# Altium project BMS_PCB.PrjPcb (part 1 of 3)
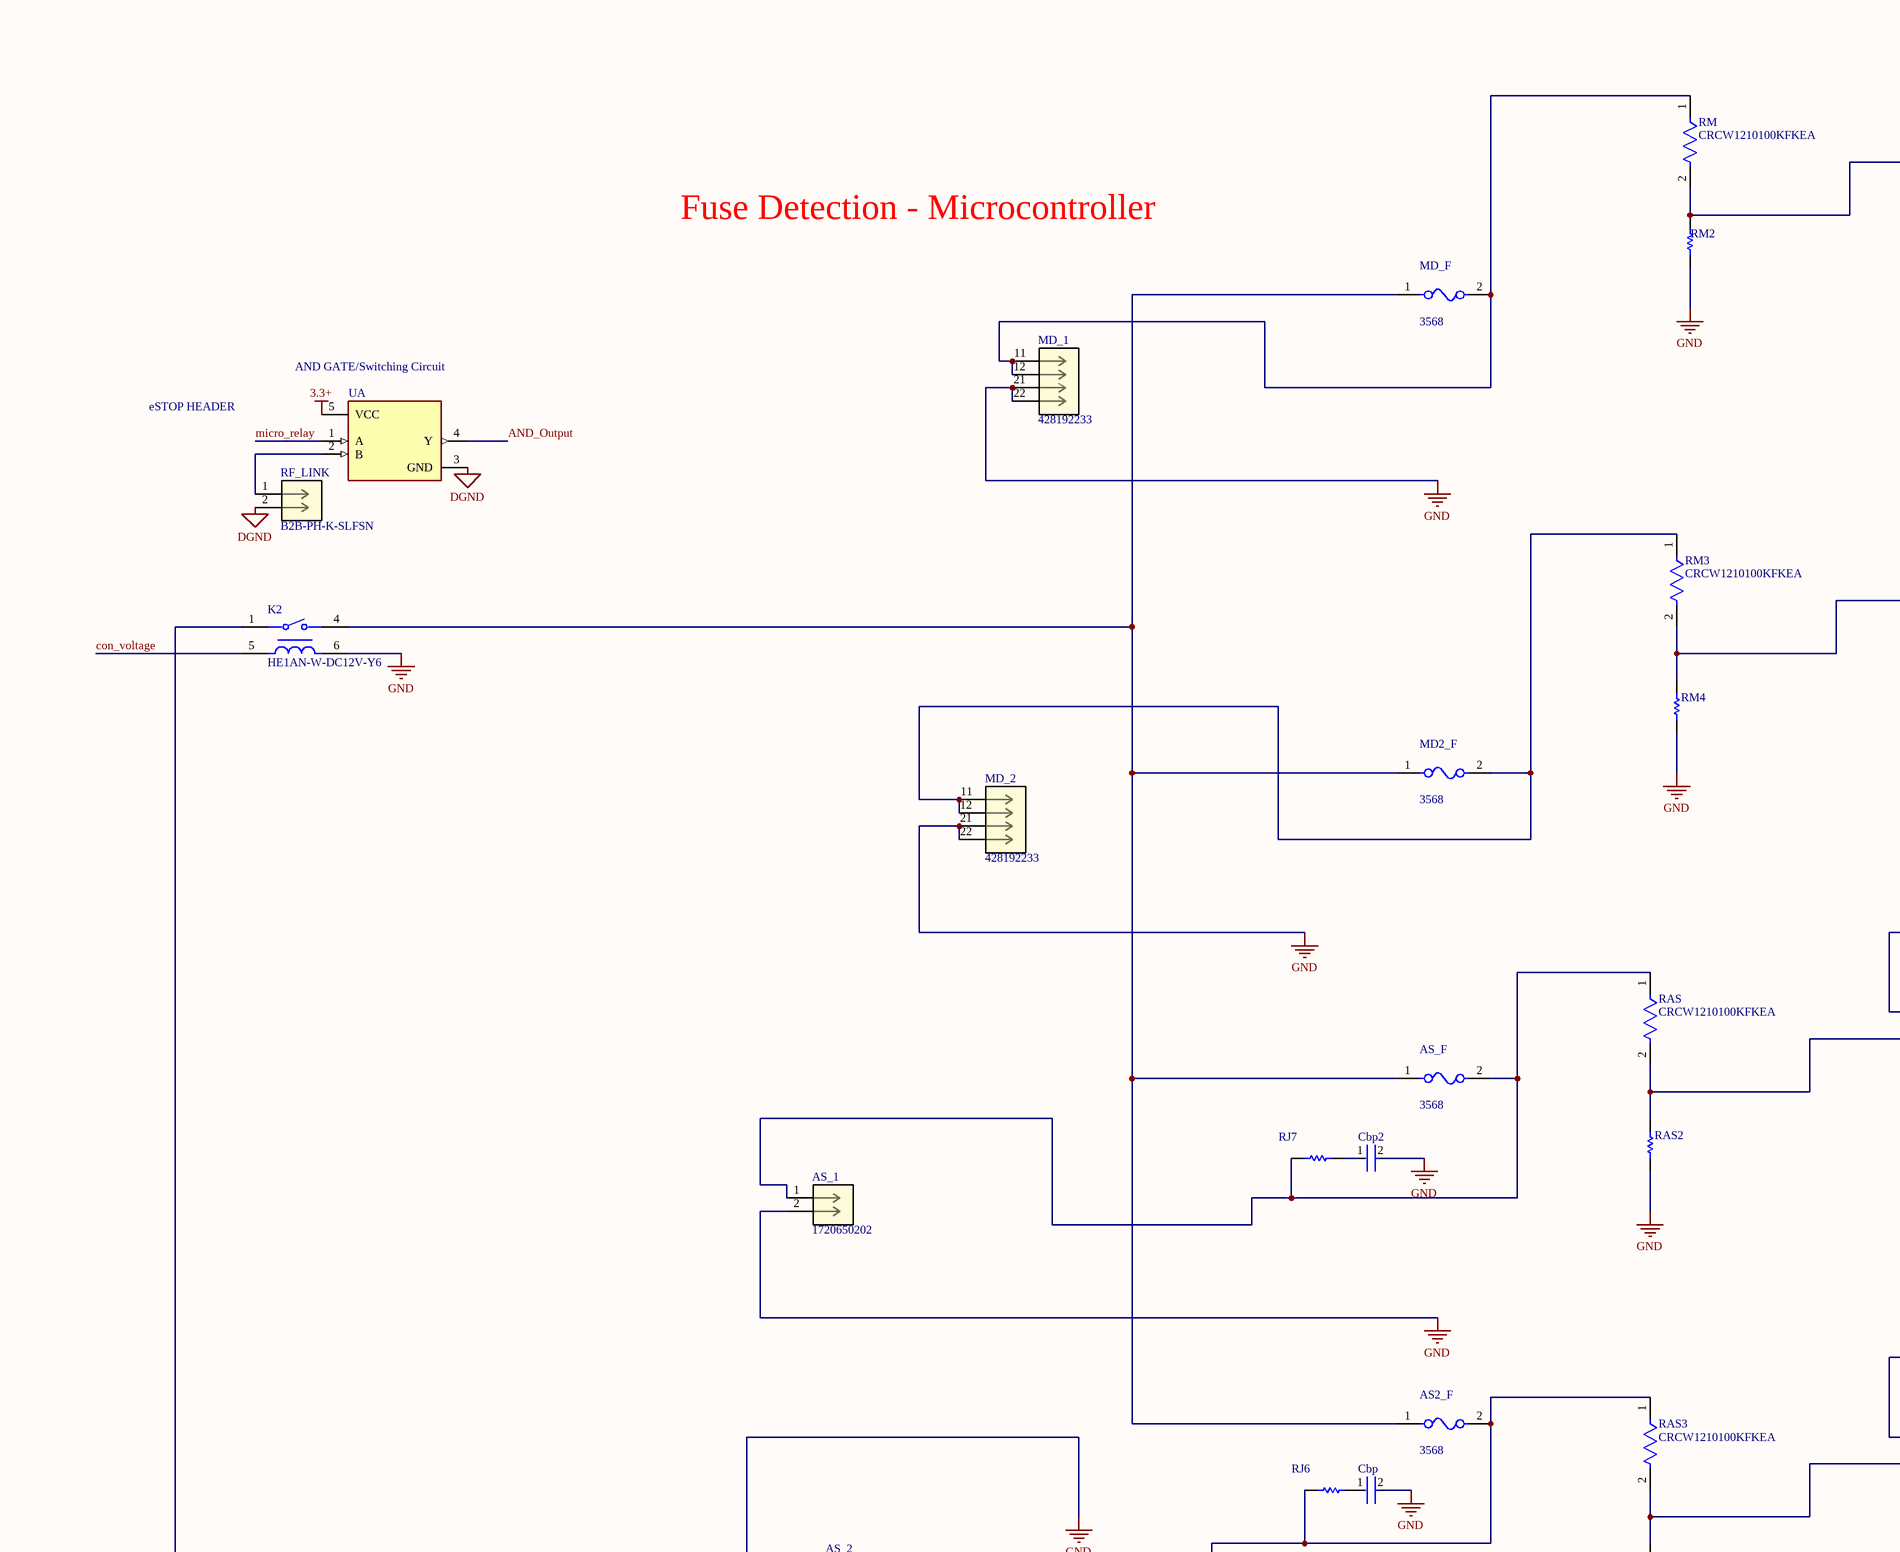
[diagram p0: BuckConverters.SchDoc, row 1 of 4 left]
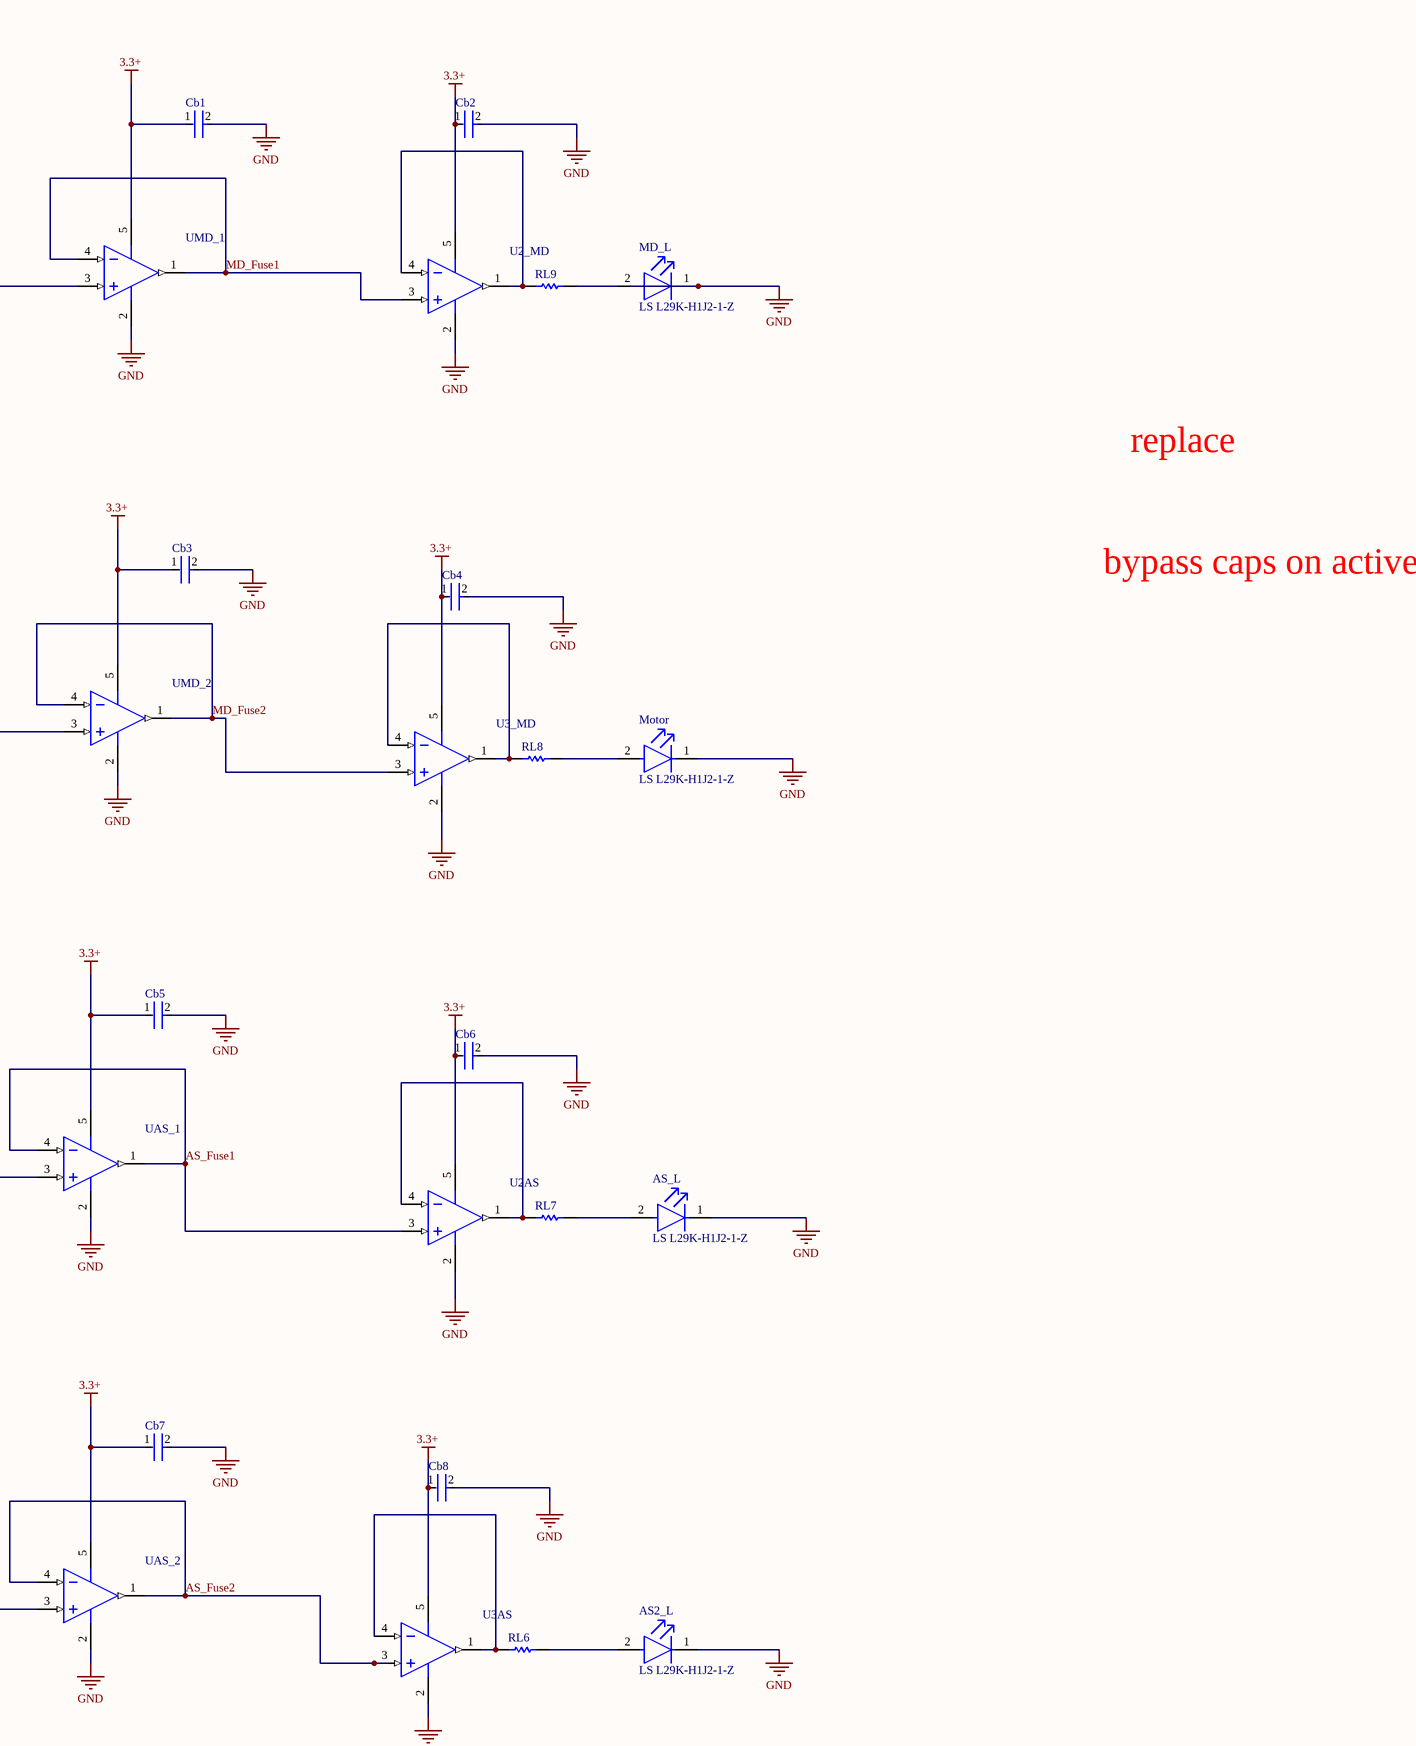
[diagram p1: BuckConverters.SchDoc, row 1 of 4 right]
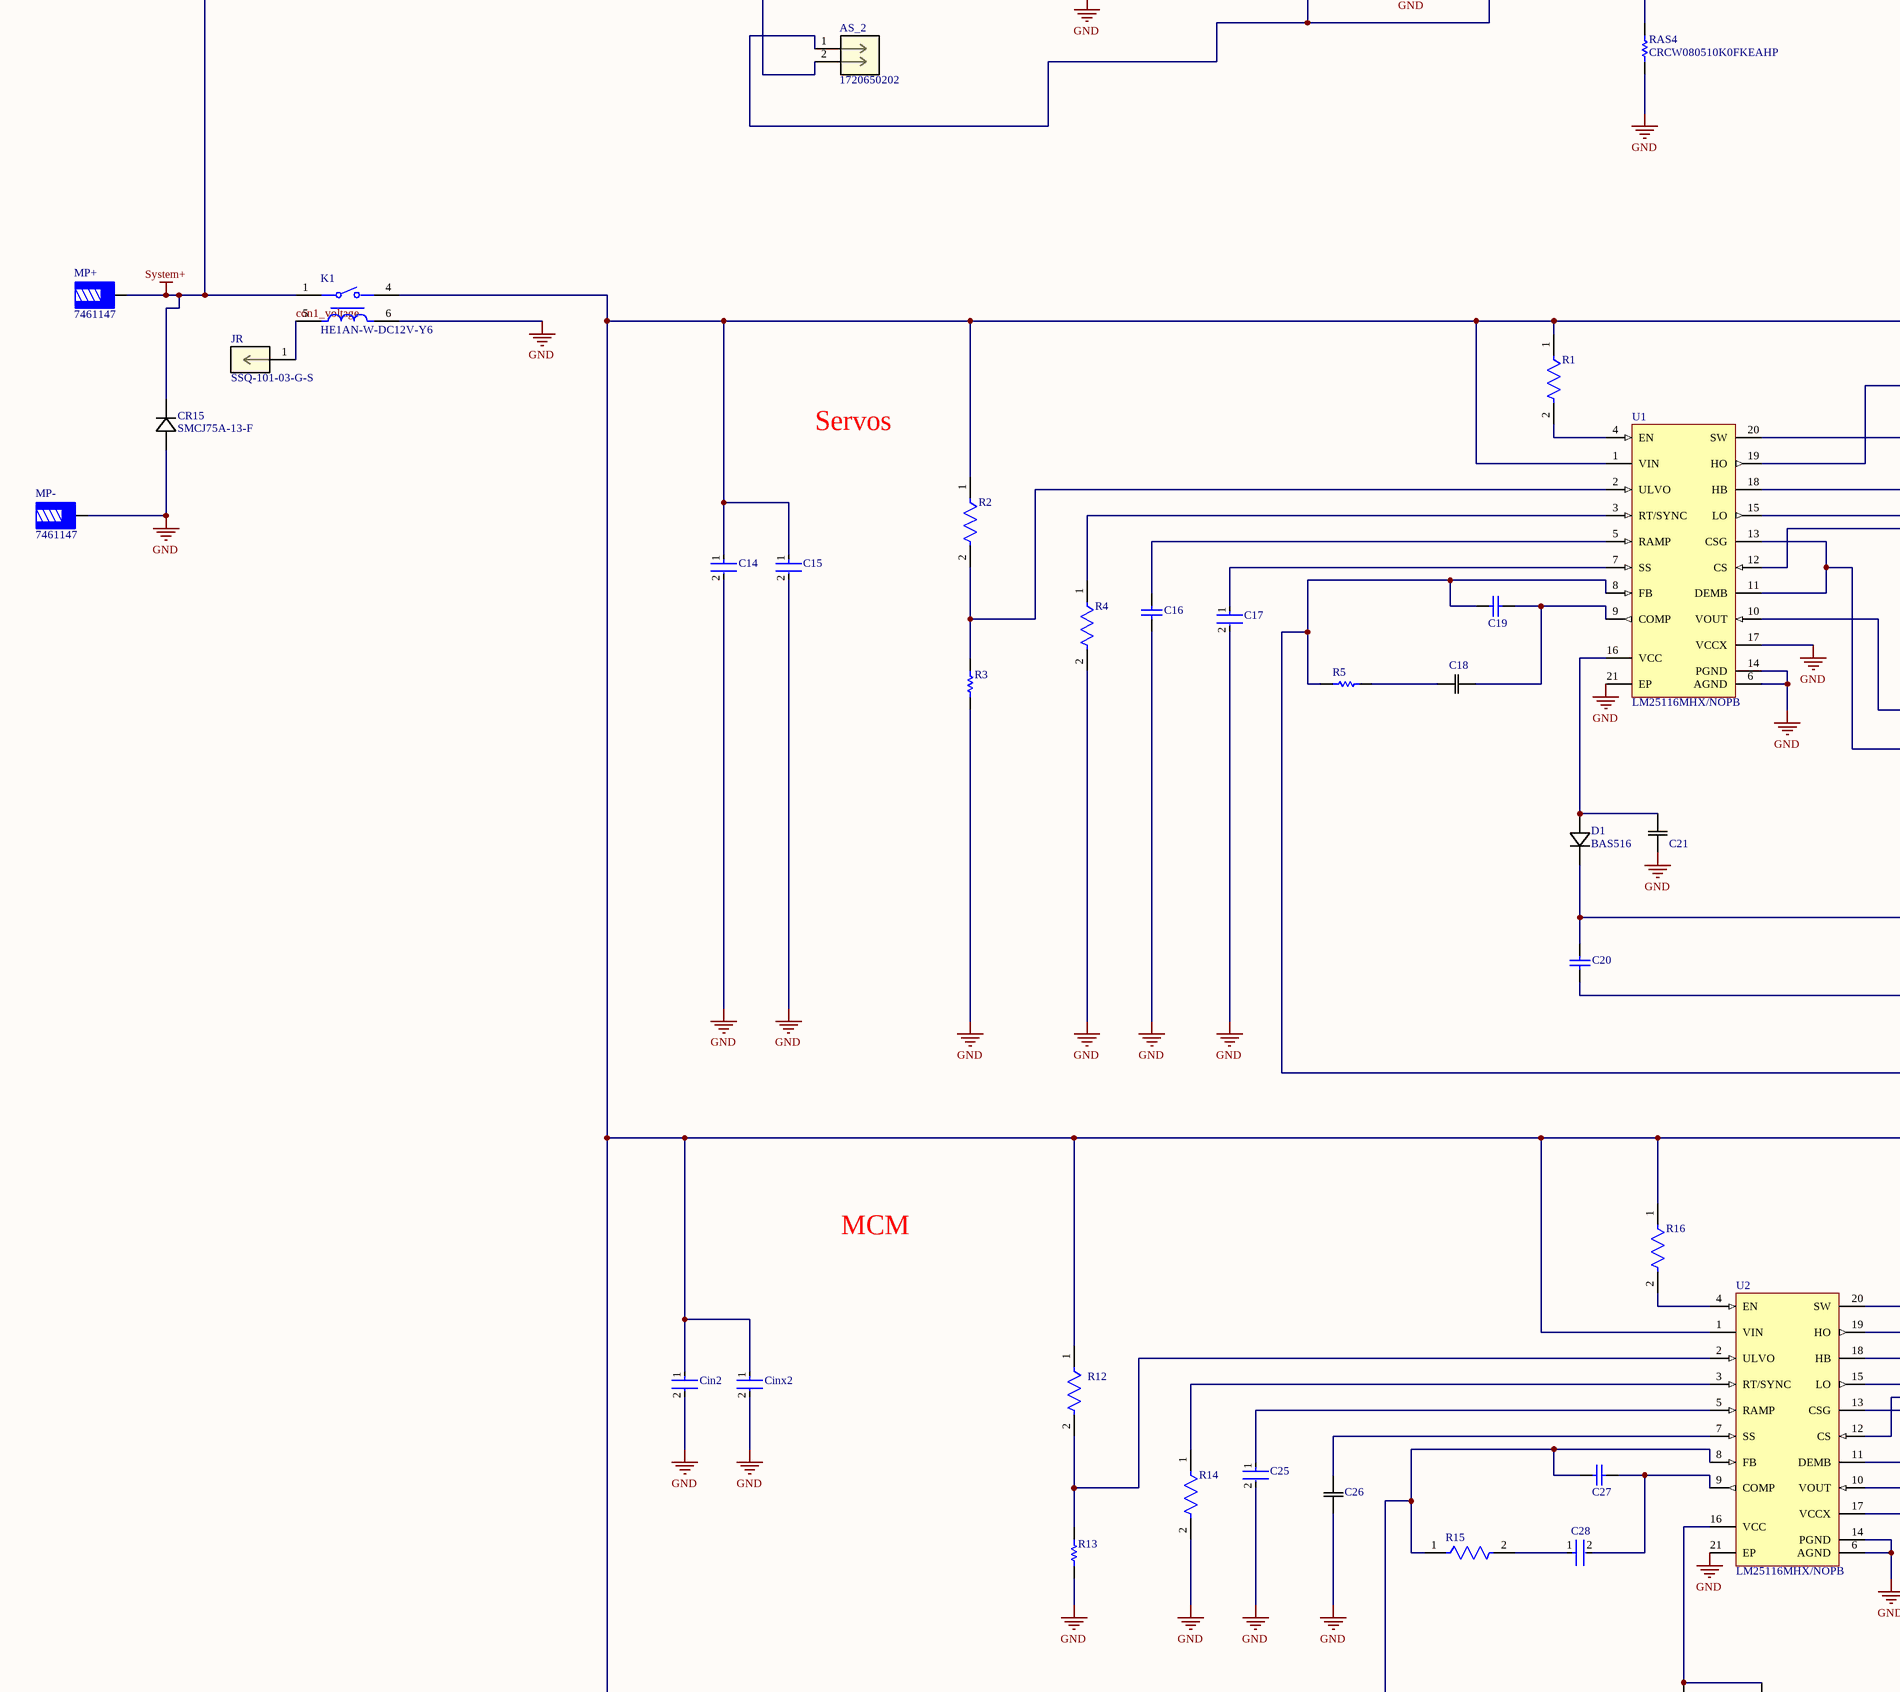
[diagram p2: BuckConverters.SchDoc, row 2 of 4 left]
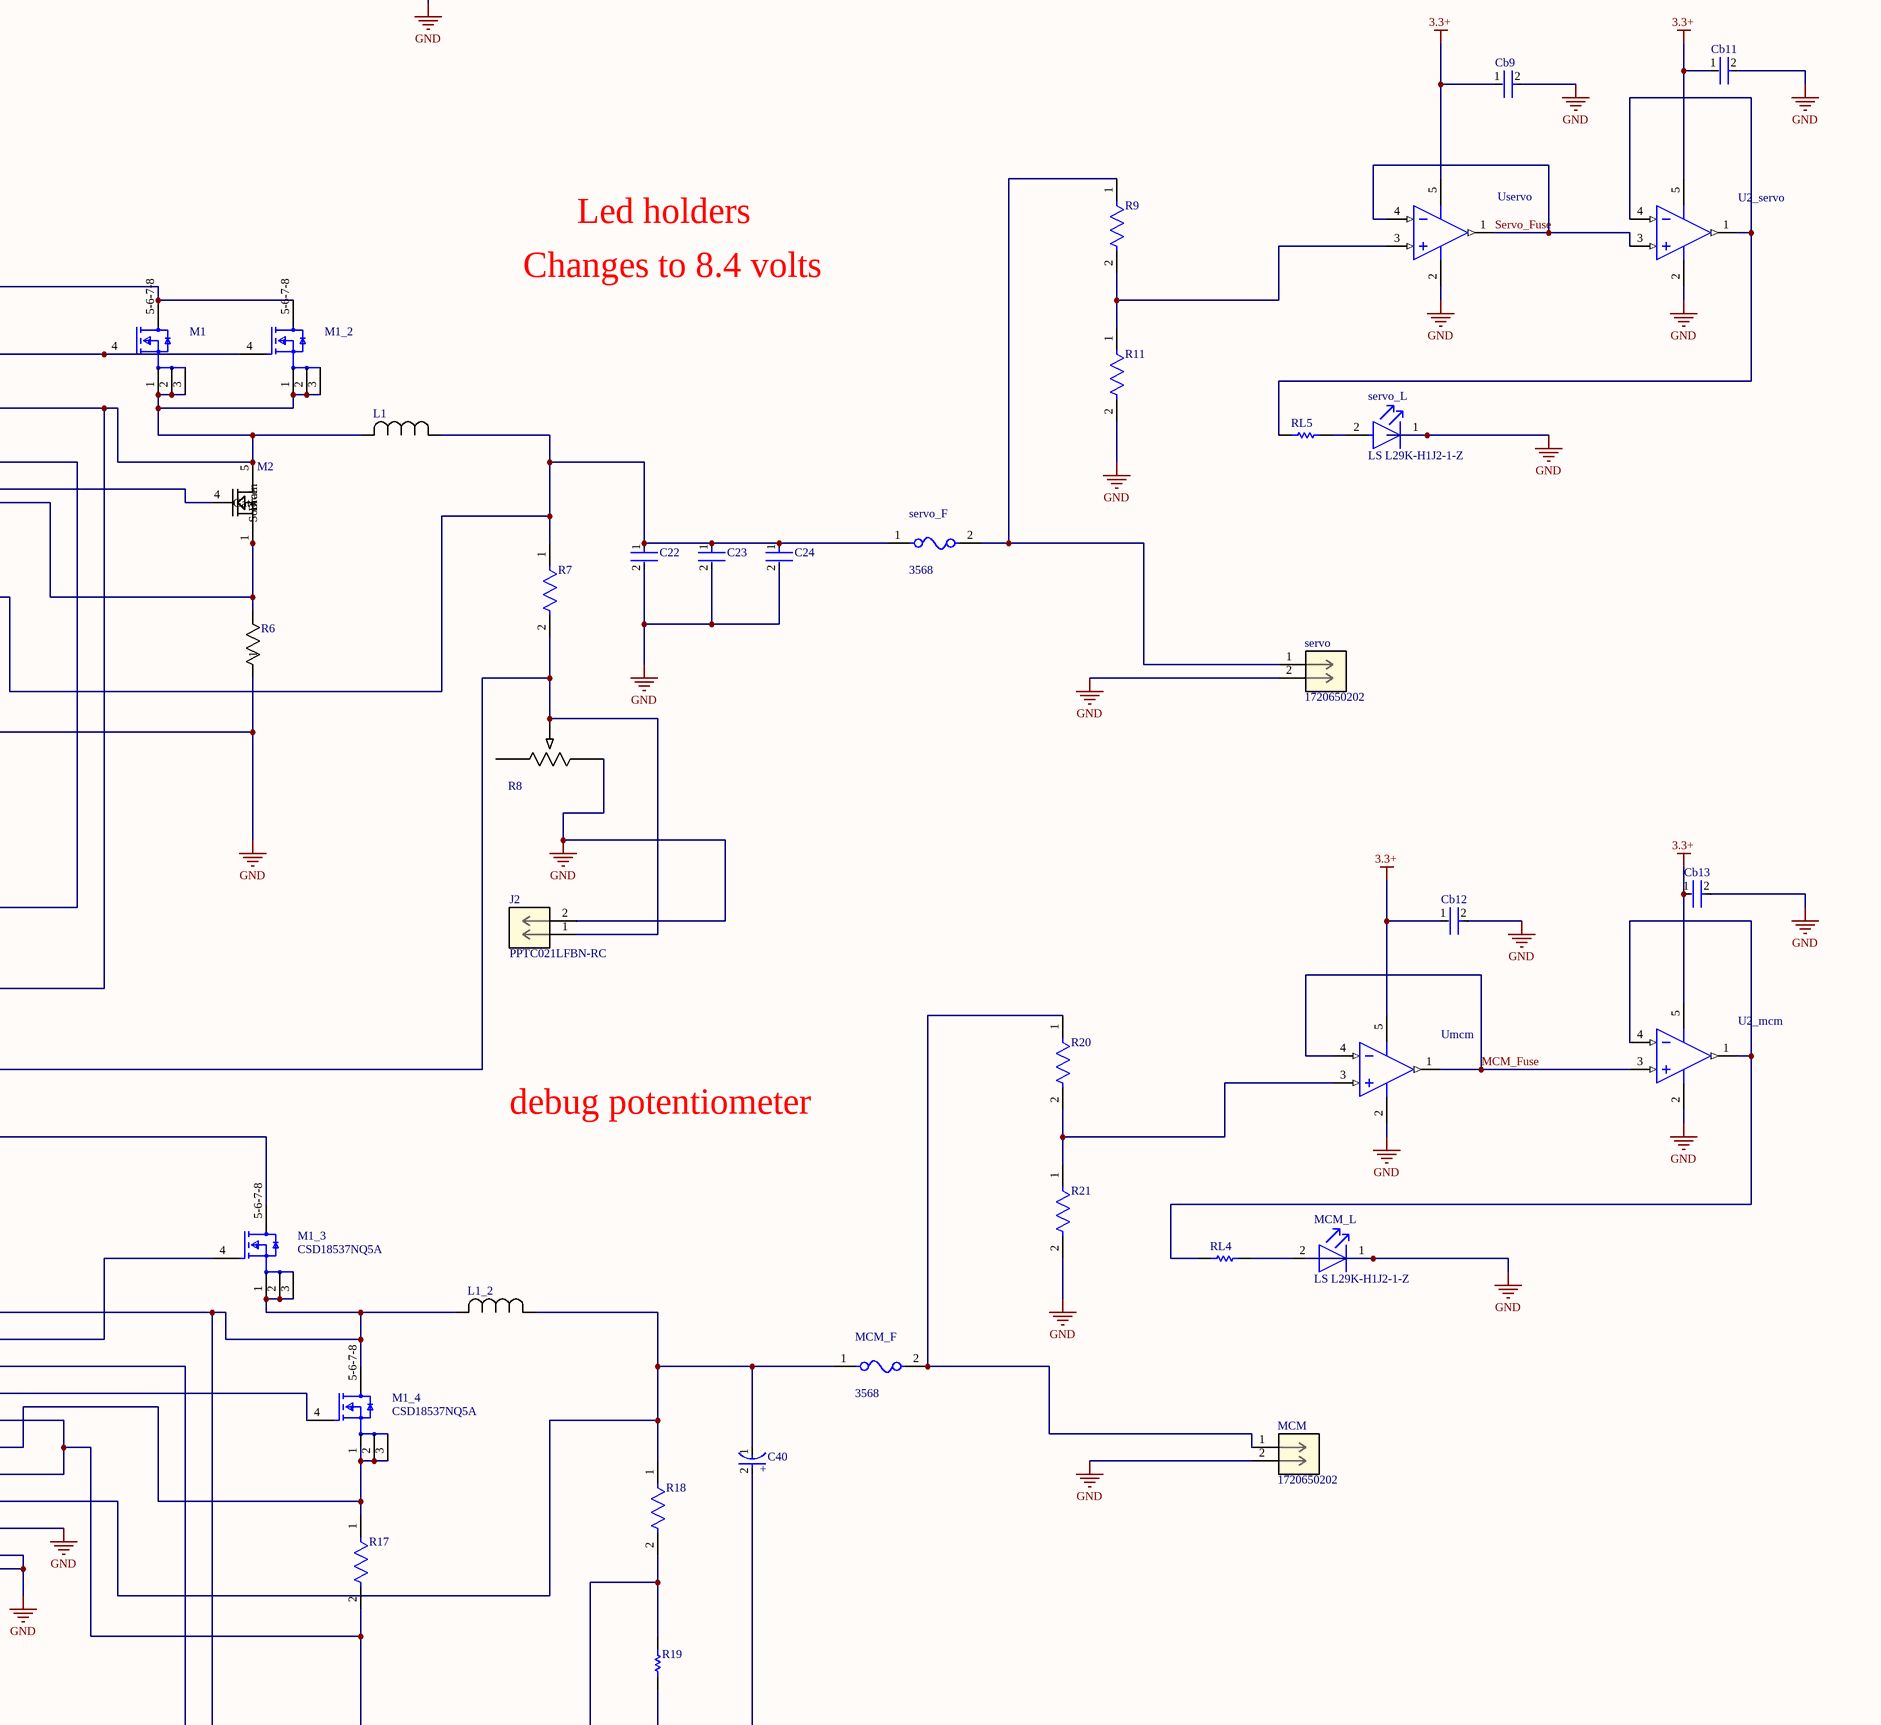
[diagram p3: BuckConverters.SchDoc, row 2 of 4 right]
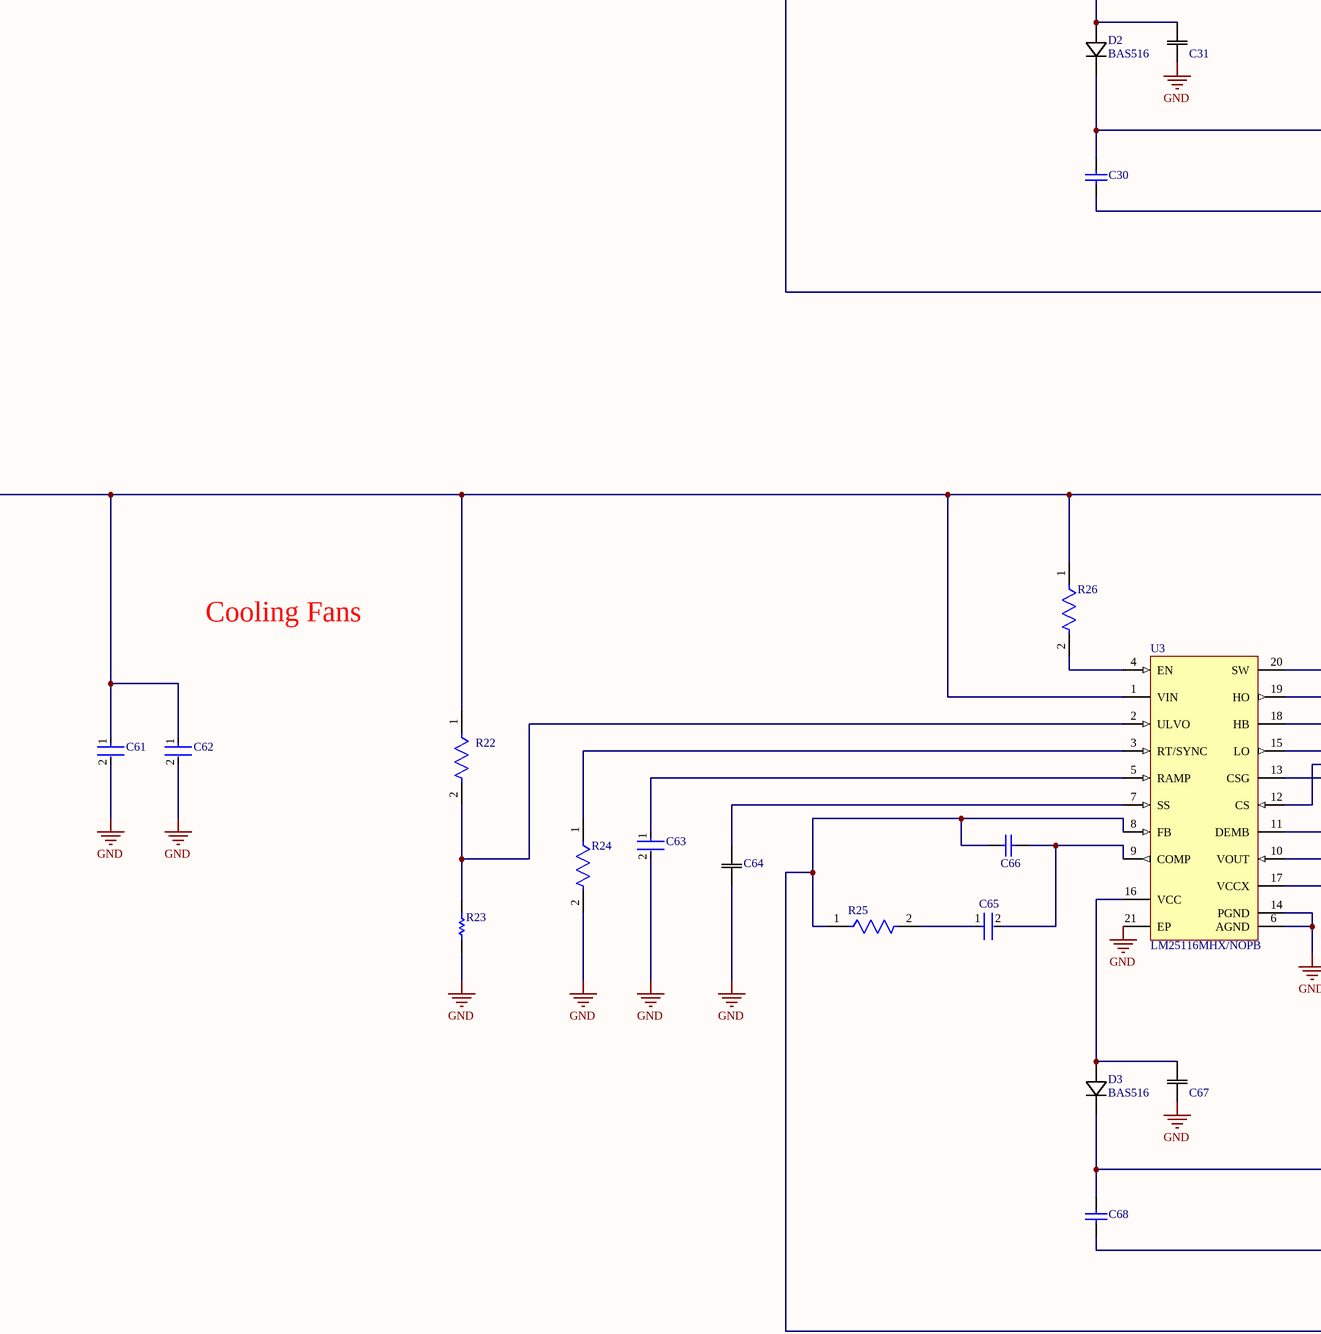
[diagram p4: BuckConverters.SchDoc, row 3 of 4 left]
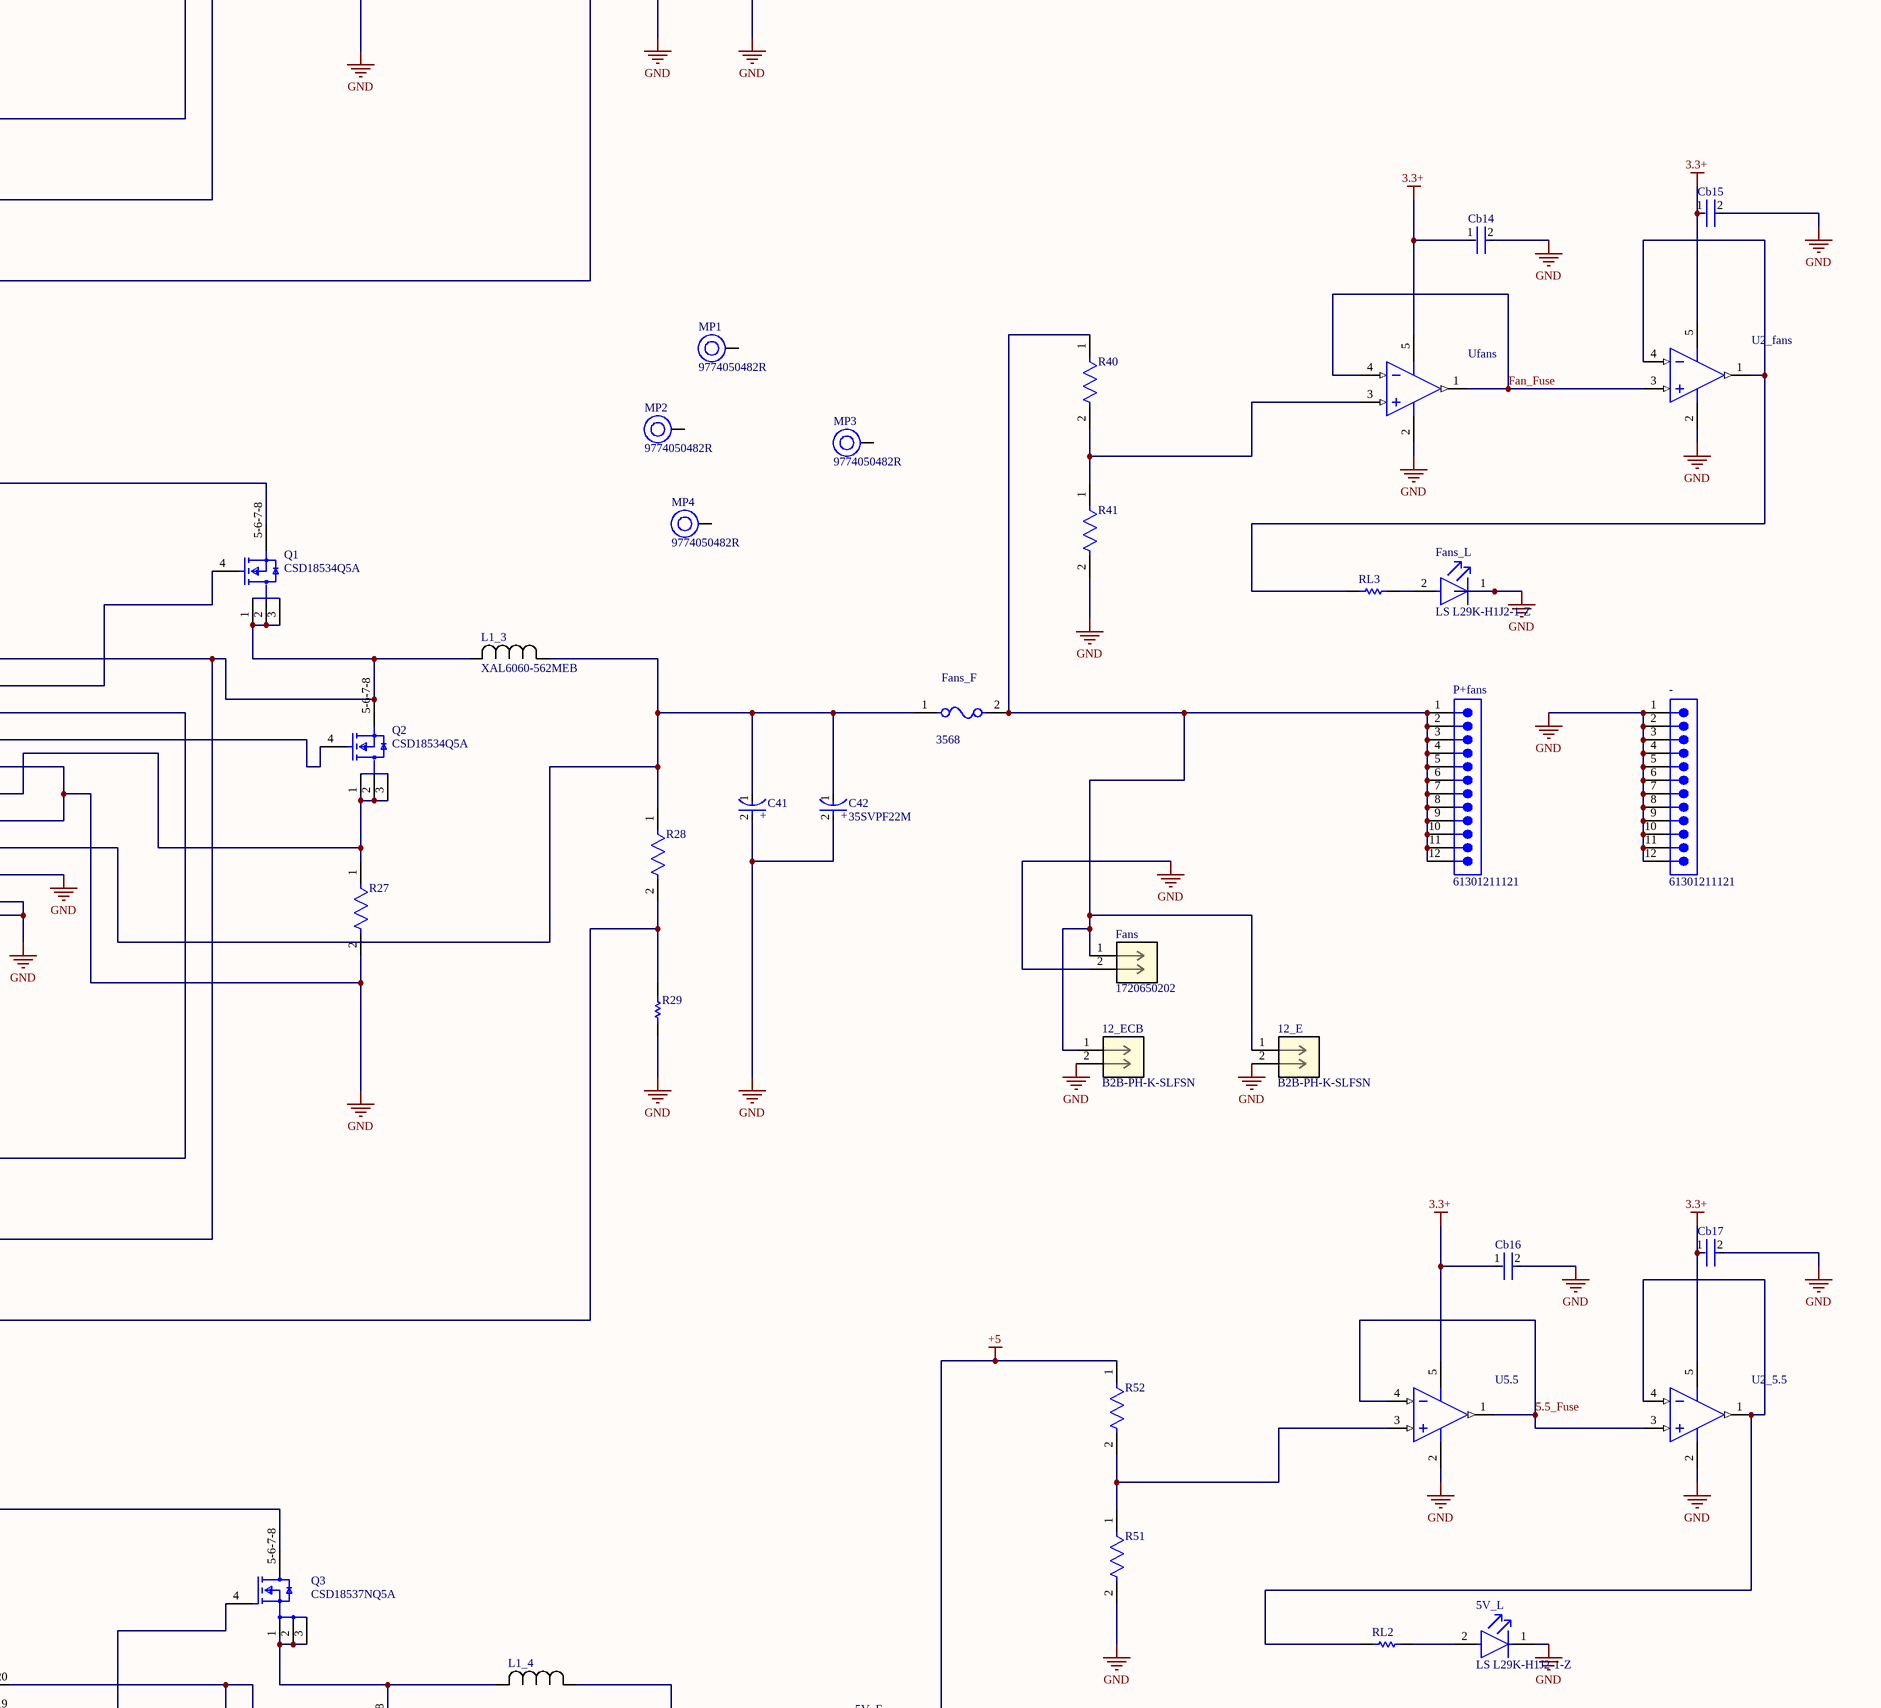
[diagram p5: BuckConverters.SchDoc, row 3 of 4 right]
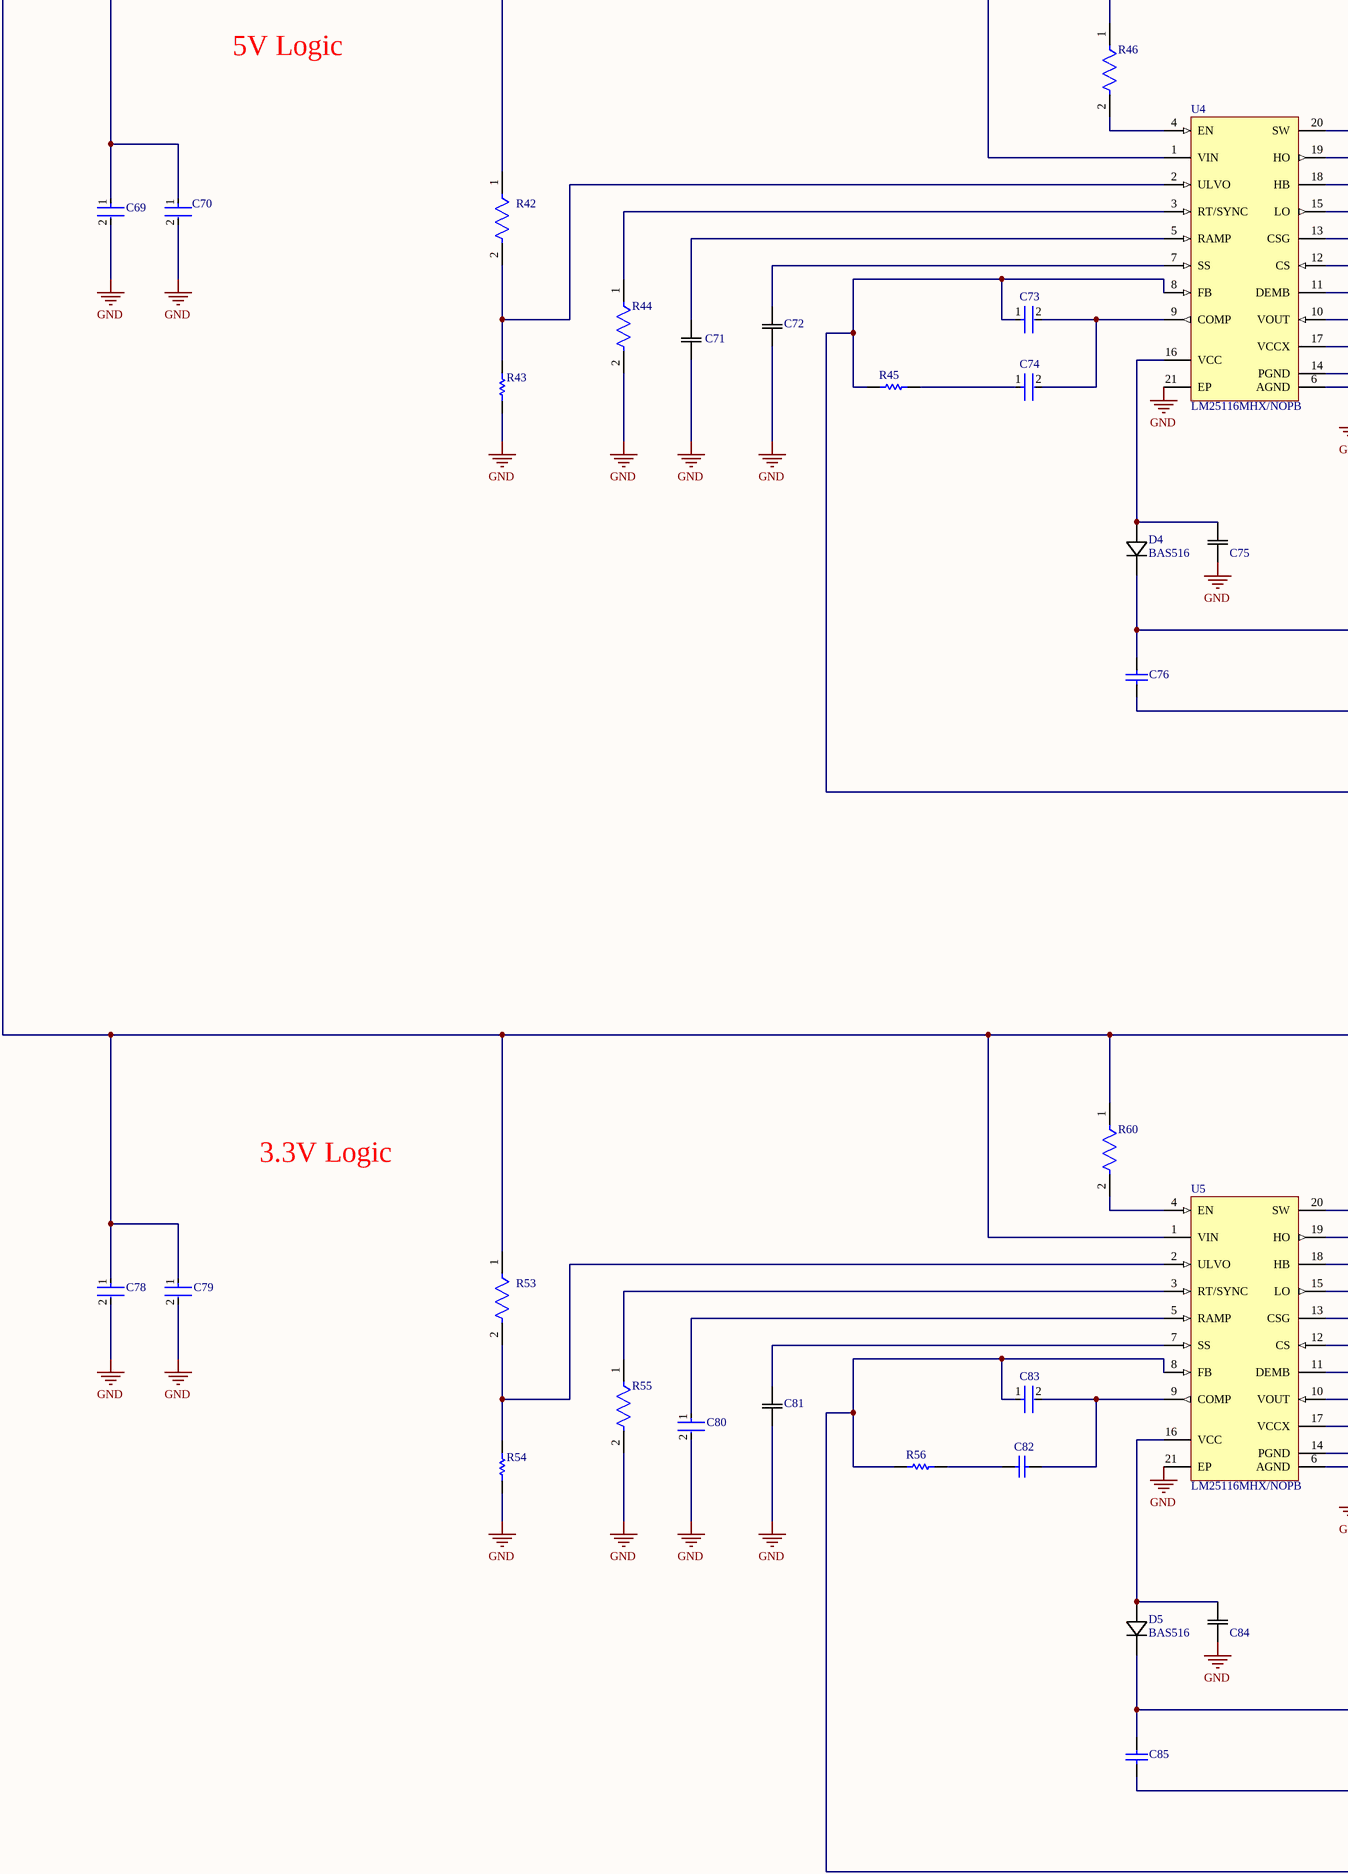
[diagram p6: BuckConverters.SchDoc, row 4 of 4 left]
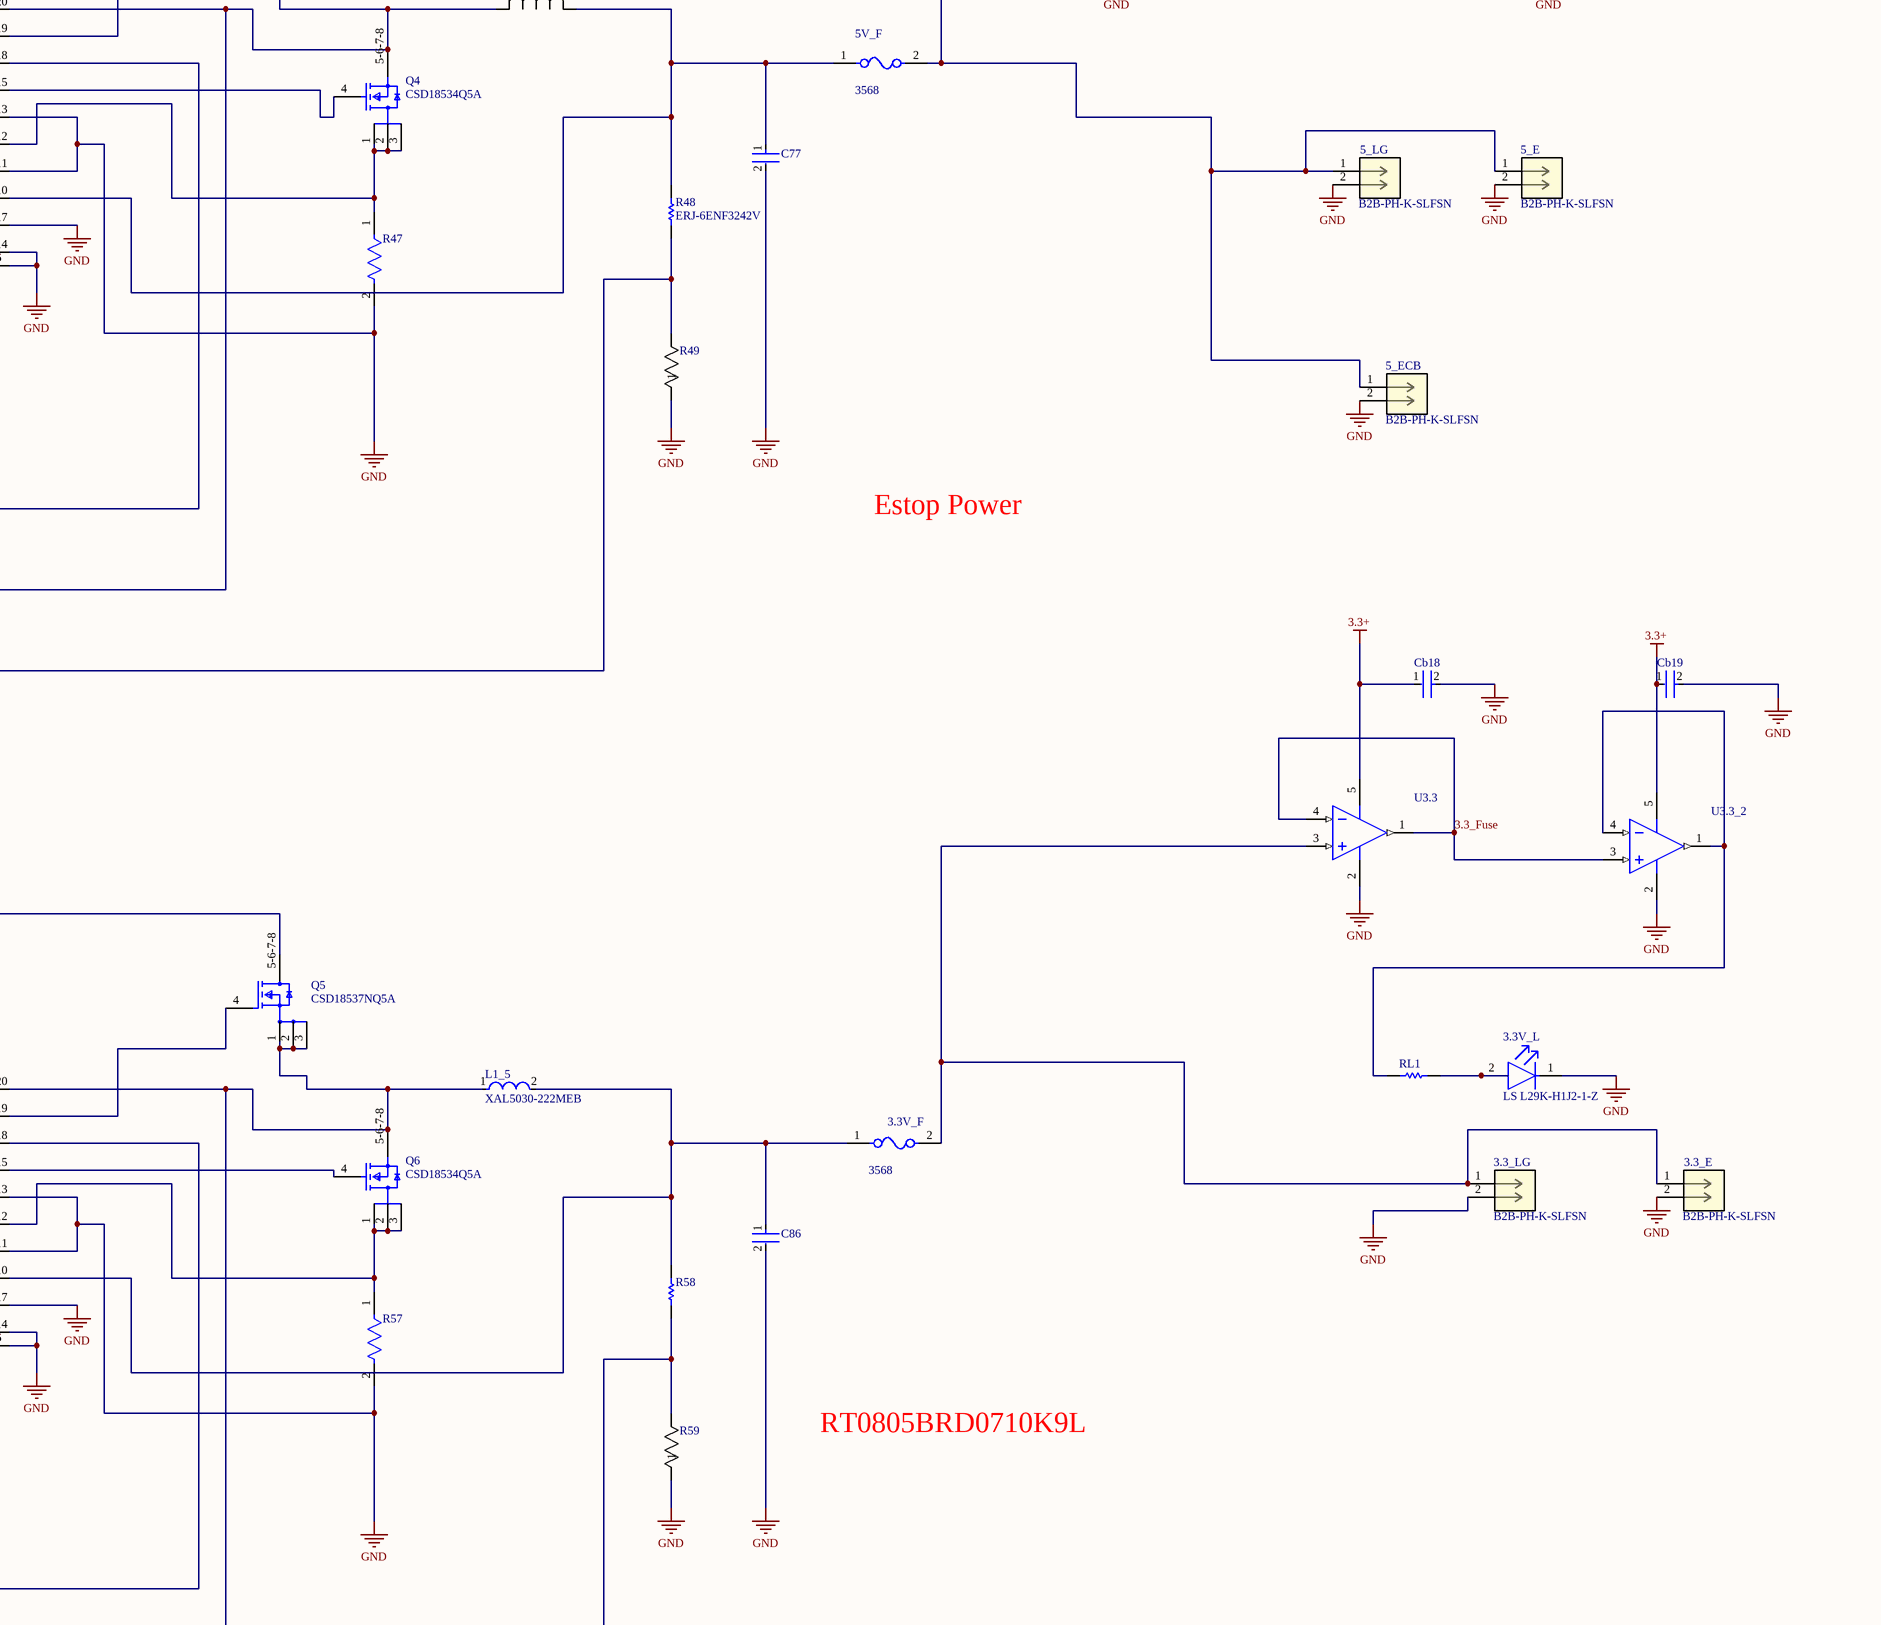
[diagram p7: BuckConverters.SchDoc, row 4 of 4 right]
2 sheets, 321 parts. Net scope: global (net labels, ports and power ports of the same name join across sheets).
Board file: BMSPowerDistribution.PcbDoc
Sheets:
  BuckConverters.SchDoc
  Miccrocontroller.SchDoc

## Sheet BuckConverters.SchDoc
size 736 x 1397 mm; SheetNumber: 1; SheetTotal: 2; SPICEModelCacheQEJSSSJY: <root> / <DocumentId>QEJSSSJY</DocumentId> / </root>

### Parts
3.3_E  B2B-PH-K-SLFSN  [CONN_B2B-PH-K-SLFSN_JST]
3.3_LG  B2B-PH-K-SLFSN  [CONN_B2B-PH-K-SLFSN_JST]
3.3V_F  3568  [FP-3568-MFG]
3.3V_L  LS L29K-H1J2-1-Z  [FP-LS_L29K-MFG]
5_E  B2B-PH-K-SLFSN  [CONN_B2B-PH-K-SLFSN_JST]
5_ECB  B2B-PH-K-SLFSN  [CONN_B2B-PH-K-SLFSN_JST]
5_LG  B2B-PH-K-SLFSN  [CONN_B2B-PH-K-SLFSN_JST]
5V_F  3568  [FP-3568-MFG]
5V_L  LS L29K-H1J2-1-Z  [FP-LS_L29K-MFG]
12_E  B2B-PH-K-SLFSN  [CONN_B2B-PH-K-SLFSN_JST]
12_ECB  B2B-PH-K-SLFSN  [CONN_B2B-PH-K-SLFSN_JST]
-  61301211121  [61301211121]
AS2_F  3568  [FP-3568-MFG]
AS2_L  LS L29K-H1J2-1-Z  [FP-LS_L29K-MFG]
AS_1  1720650202  [CONN_SD-768290002_02_MOL]
AS_2  1720650202  [CONN_SD-768290002_02_MOL]
AS_F  3568  [FP-3568-MFG]
AS_L  LS L29K-H1J2-1-Z  [FP-LS_L29K-MFG]
C14  GRM31CR71H475KA12L  [FP-GRM31C-0_2-e0_3_0_8-IPC_C]  (value not drawn)
C15  C0805C104M5RACTU  [FP-C0805C-DN-MFG]  (value not drawn)
C16  GRM1555C1H301GA01D  [CAPC1005X55X25LL05T10]  (value not drawn)
C17  C1206C333J1GACTU  [FP-C1206C-EB-MFG]  (value not drawn)
C18  UMK105CG181JV-F  [cap_UMK105 CG080CV-F_TAY]  (value not drawn)
C19  GRM1555C1E5R1CA01D  [CAPC1005X55X25LL05T10]  (value not drawn)
C20  08053C104K4T2A  [CAPC2013X140X50LL20T25]  (value not drawn)
C21  TMK212BJ105KG-T  [CAP_TMK212BJ105KG-T_TAY]  (value not drawn)
C22  CGA9N3X7R1C476M230KB  [FP-CGA9P-IPC_A]  (value not drawn)
C23  CGA9N3X7R1C476M230KB  [FP-CGA9P-IPC_A]  (value not drawn)
C24  CGA9N3X7R1C476M230KB  [FP-CGA9P-IPC_A]  (value not drawn)
C25  UMK105CG271JV-F  [FP-0402-L_1_0_0_05-W_0_5-IPC_B]  (value not drawn)
C26  CGA4J2C0G1H333J125AA  [CAP_2012_TDK-M]  (value not drawn)
C27  GRM1555C1E5R1CA01D  [CAPC1005X55X25LL05T10]  (value not drawn)
C28  GRM1555C1H101FA01D  [FP-GRM155-0_05-IPC_C]  (value not drawn)
C30  08053C104K4T2A  [CAPC2013X140X50LL20T25]  (value not drawn)
C31  TMK212BJ105KG-T  [CAP_TMK212BJ105KG-T_TAY]  (value not drawn)
C40  25SVPF27MX  [FP-OS-CON-SMT-B6-MFG]  (value not drawn)
C41  35SVPF22M  [FP-OS-CON-SMT-C6-MFG]  (value not drawn)
C42  35SVPF22M  [FP-OS-CON-SMT-C6-MFG]
C61  GRM31CR71H475KA12L  [FP-GRM31C-0_2-e0_3_0_8-IPC_C]  (value not drawn)
C62  C0805C104M5RACTU  [FP-C0805C-DN-MFG]  (value not drawn)
C63  UMK105CG271JV-F  [FP-0402-L_1_0_0_05-W_0_5-IPC_B]  (value not drawn)
C64  CGA4J2C0G1H333J125AA  [CAP_2012_TDK-M]  (value not drawn)
C65  GRM1555C1H101FA01D  [FP-GRM155-0_05-IPC_C]  (value not drawn)
C66  GRM1555C1E5R1CA01D  [CAPC1005X55X25LL05T10]  (value not drawn)
C67  TMK212BJ105KG-T  [CAP_TMK212BJ105KG-T_TAY]  (value not drawn)
C68  08053C104K4T2A  [CAPC2013X140X50LL20T25]  (value not drawn)
C69  GRM31CR71H475KA12L  [FP-GRM31C-0_2-e0_3_0_8-IPC_C]  (value not drawn)
C70  C0805C104M5RACTU  [FP-C0805C-DN-MFG]  (value not drawn)
C71  UMK105CG181JV-F  [cap_UMK105 CG080CV-F_TAY]  (value not drawn)
C72  CGA4J2C0G1H333J125AA  [CAP_2012_TDK-M]  (value not drawn)
C73  C0805C100M4GACTU  [FP-C0805C-DN-MFG]  (value not drawn)
C74  UMK105CG271JV-F  [FP-0402-L_1_0_0_05-W_0_5-IPC_B]  (value not drawn)
C75  TMK212BJ105KG-T  [CAP_TMK212BJ105KG-T_TAY]  (value not drawn)
C76  08053C104K4T2A  [CAPC2013X140X50LL20T25]  (value not drawn)
C77  GRM32ER61C476KE15L  [FP-GRM32E-0_3-0_2-IPC_C]  (value not drawn)
C78  GRM31CR71H475KA12L  [FP-GRM31C-0_2-e0_3_0_8-IPC_C]  (value not drawn)
C79  C0805C104M5RACTU  [FP-C0805C-DN-MFG]  (value not drawn)
C80  GRM1555C1H101FA01D  [FP-GRM155-0_05-IPC_C]  (value not drawn)
C81  CGA4J2C0G1H333J125AA  [CAP_2012_TDK-M]  (value not drawn)
C82  GRM1555C1E120JA01D  [CAPC1005X55X25LL05T10]  (value not drawn)
C83  GRM1555C1H391JA01J  [FP-GRM155-0_05-IPC_A]  (value not drawn)
C84  TMK212BJ105KG-T  [CAP_TMK212BJ105KG-T_TAY]  (value not drawn)
C85  08053C104K4T2A  [CAPC2013X140X50LL20T25]  (value not drawn)
C86  GRM32ER61C476KE15L  [FP-GRM32E-0_3-0_2-IPC_C]  (value not drawn)
Cb1  GCJ188R72A104KA01D  [FP-GCJ188-0_2-IPC_A]  (value not drawn)
Cb2  GCJ188R72A104KA01D  [FP-GCJ188-0_2-IPC_A]  (value not drawn)
Cb3  GCJ188R72A104KA01D  [FP-GCJ188-0_2-IPC_A]  (value not drawn)
Cb4  GCJ188R72A104KA01D  [FP-GCJ188-0_2-IPC_A]  (value not drawn)
Cb5  GCJ188R72A104KA01D  [FP-GCJ188-0_2-IPC_A]  (value not drawn)
Cb6  GCJ188R72A104KA01D  [FP-GCJ188-0_2-IPC_A]  (value not drawn)
Cb7  GCJ188R72A104KA01D  [FP-GCJ188-0_2-IPC_A]  (value not drawn)
Cb8  GCJ188R72A104KA01D  [FP-GCJ188-0_2-IPC_A]  (value not drawn)
Cb9  GCJ188R72A104KA01D  [FP-GCJ188-0_2-IPC_A]  (value not drawn)
Cb11  GCJ188R72A104KA01D  [FP-GCJ188-0_2-IPC_A]  (value not drawn)
Cb12  GCJ188R72A104KA01D  [FP-GCJ188-0_2-IPC_A]  (value not drawn)
Cb13  GCJ188R72A104KA01D  [FP-GCJ188-0_2-IPC_A]  (value not drawn)
Cb14  GCJ188R72A104KA01D  [FP-GCJ188-0_2-IPC_A]  (value not drawn)
Cb15  GCJ188R72A104KA01D  [FP-GCJ188-0_2-IPC_A]  (value not drawn)
Cb16  GCJ188R72A104KA01D  [FP-GCJ188-0_2-IPC_A]  (value not drawn)
Cb17  GCJ188R72A104KA01D  [FP-GCJ188-0_2-IPC_A]  (value not drawn)
Cb18  GCJ188R72A104KA01D  [FP-GCJ188-0_2-IPC_A]  (value not drawn)
Cb19  GCJ188R72A104KA01D  [FP-GCJ188-0_2-IPC_A]  (value not drawn)
Cbp  GCJ188R72A104KA01D  [FP-GCJ188-0_2-IPC_A]  (value not drawn)
Cbp2  GCJ188R72A104KA01D  [FP-GCJ188-0_2-IPC_A]  (value not drawn)
Cin2  GRM31CR71H475KA12L  [FP-GRM31C-0_2-e0_3_0_8-IPC_C]  (value not drawn)
Cinx2  C0805C104M5RACTU  [FP-C0805C-DN-MFG]  (value not drawn)
CR15  SMCJ75A-13-F  [SMC_DIO]
D1  BAS516  [SOD523_NEX]
D2  BAS516  [SOD523_NEX]
D3  BAS516  [SOD523_NEX]
D4  BAS516  [SOD523_NEX]
D5  BAS516  [SOD523_NEX]
Fans  1720650202  [CONN_SD-768290002_02_MOL]
Fans_F  3568  [FP-3568-MFG]
Fans_L  LS L29K-H1J2-1-Z  [FP-LS_L29K-MFG]
J2  PPTC021LFBN-RC  [CONN2_LFBN-RC_SUL - duplicate]
JR  SSQ-101-03-G-S  [CON1_1X1_TU_SSQ]
K1  HE1AN-W-DC12V-Y6  [FP-HE1AN-W-DC12V-Y6-MFG]
K2  HE1AN-W-DC12V-Y6  [FP-HE1AN-W-DC12V-Y6-MFG]
L1  IHLP5050FDER1R8M01  [IND_IHLP_5050_FD_VIS]  (value not drawn)
L1_2  MSS1038-123MLB  [IND_MSS1038_COC]  (value not drawn)
L1_3  XAL6060-562MEB  [IND_XAL6060_COC]
L1_4  SER1052-402MLB  [IND_SER1052_COC]  (value not drawn)
L1_5  XAL5030-222MEB  [FP-XAL5030-222MEB-MFG]
M1  CSD18537NQ5A  [FP-DQJ0008A-MFG]  (value not drawn)
M1_2  CSD18537NQ5A  [FP-DQJ0008A-MFG]  (value not drawn)
M1_3  CSD18537NQ5A  [FP-DQJ0008A-MFG]
M1_4  CSD18537NQ5A  [FP-DQJ0008A-MFG]
M2  CSD16556Q5B  [DNK0008A]  (value not drawn)
MCM  1720650202  [CONN_SD-768290002_02_MOL]
MCM_F  3568  [FP-3568-MFG]
MCM_L  LS L29K-H1J2-1-Z  [FP-LS_L29K-MFG]
MD2_F  3568  [FP-3568-MFG]
MD_1  428192233  [CON_428192233]
MD_2  428192233  [CON_428192233]
MD_F  3568  [FP-3568-MFG]
MD_L  LS L29K-H1J2-1-Z  [FP-LS_L29K-MFG]
Motor  LS L29K-H1J2-1-Z  [FP-LS_L29K-MFG]
MP1  9774050482R  [9774050482]
MP2  9774050482R  [9774050482]
MP3  9774050482R  [9774050482]
MP4  9774050482R  [9774050482]
MP+  7461147  [7461147_chemical surface]
MP-  7461147  [7461147_chemical surface]
P+fans  61301211121  [61301211121]
Q1  CSD18534Q5A  [FP-DQJ0008A-MFG]
Q2  CSD18534Q5A  [FP-DQJ0008A-MFG]
Q3  CSD18537NQ5A  [FP-DQJ0008A-MFG]
Q4  CSD18534Q5A  [FP-DQJ0008A-MFG]
Q5  CSD18537NQ5A  [FP-DQJ0008A-MFG]
Q6  CSD18534Q5A  [FP-DQJ0008A-MFG]
R1  CRCW04021M00FKED  [FP-CRCW0402-e3-MFG]  (value not drawn)
R2  CRCW080541K2FKEA  [Vishay_CRCW0805-e3_MFG]  (value not drawn)
R3  ERJ-6ENF2491V  [RESC2013X70X40LL20T20]  (value not drawn)
R4  CRCW04025K23FKED  [FP-CRCW0402-e3-IPC_C]  (value not drawn)
R5  CRCW0402102KFKED  [RESC1005X40X25ML05T05]  (value not drawn)
R6  CSNL1206FT3L00  [STA_CSNL1206_STP]  (value not drawn)
R7  CRCW120656K0FKEA  [FP-CRCW1206-e3-IPC_C]  (value not drawn)
R8  3296X-1-102LF  [POT_3296X]  (value not drawn)
R9  RC0603FR-0710KL  [FP-RC0603-0_55-IPC_C]  (value not drawn)
R11  CRCW06035K10FKEA  [FP-CRCW0603-e3-IPC_C]  (value not drawn)
R12  CRCW080541K2FKEA  [Vishay_CRCW0805-e3_MFG]  (value not drawn)
R13  ERJ-6ENF2491V  [RESC2013X70X40LL20T20]  (value not drawn)
R14  CRCW04025K23FKED  [FP-CRCW0402-e3-IPC_C]  (value not drawn)
R15  CRCW0402191KFKED  [FP-CRCW0402-e3-IPC_C]  (value not drawn)
R16  CRCW04021M00FKED  [FP-CRCW0402-e3-MFG]  (value not drawn)
R17  CSR1206FK15L0  [FP-CSR1206-IPC_B]  (value not drawn)
R18  AC0402FR-0786K6L  [FP-AC0402-IPC_B]  (value not drawn)
R19  ERJ-6ENF9761V  [RESC2013X70X40ML20T20]  (value not drawn)
R20  RC0603FR-0710KL  [FP-RC0603-0_55-IPC_C]  (value not drawn)
R21  RC0603FR-073K3L  [FP-RC0603-0_55-MFG]  (value not drawn)
R22  CRCW080541K2FKEA  [Vishay_CRCW0805-e3_MFG]  (value not drawn)
R23  ERJ-6ENF2491V  [RESC2013X70X40LL20T20]  (value not drawn)
R24  CRCW04025K23FKED  [FP-CRCW0402-e3-IPC_C]  (value not drawn)
R25  CRCW0402143KFKED  [FP-CRCW0402-e3-IPC_A]  (value not drawn)
R26  CRCW04021M00FKED  [FP-CRCW0402-e3-MFG]  (value not drawn)
R27  PRL1632-R007-F-T1  [FP-PRL1632-IPC_C]  (value not drawn)
R28  AC0402FR-0786K6L  [FP-AC0402-IPC_B]  (value not drawn)
R29  ERJ-6ENF9761V  [RESC2013X70X40ML20T20]  (value not drawn)
R40  RC0603FR-0710KL  [FP-RC0603-0_55-IPC_C]  (value not drawn)
R41  RC0603FR-073K3L  [FP-RC0603-0_55-MFG]  (value not drawn)
R42  CRCW080541K2FKEA  [Vishay_CRCW0805-e3_MFG]  (value not drawn)
R43  ERJ-6ENF2491V  [RESC2013X70X40LL20T20]  (value not drawn)
R44  CRCW04025K23FKED  [FP-CRCW0402-e3-IPC_C]  (value not drawn)
R45  CRCW040266K5FKED  [RESC1005X40X25ML05T05]  (value not drawn)
R46  CRCW04021M00FKED  [FP-CRCW0402-e3-MFG]  (value not drawn)
R47  CSR1206FK12L0  [FP-CSR1206-IPC_B]  (value not drawn)
R48  ERJ-6ENF3242V  [RESC2013X70X40ML20T20]
R49  RNCF0805BTE10K4  [RES_RNCF0805_STP]  (value not drawn)
R51  RC0603FR-0720KL  [FP-RC0603-0_55-IPC_C]  (value not drawn)
R52  RC0603FR-0710KL  [FP-RC0603-0_55-IPC_C]  (value not drawn)
R53  CRCW080541K2FKEA  [Vishay_CRCW0805-e3_MFG]  (value not drawn)
R54  ERJ-6ENF2491V  [RESC2013X70X40LL20T20]  (value not drawn)
R55  CRCW04025K23FKED  [FP-CRCW0402-e3-IPC_C]  (value not drawn)
R56  CRCW040247K5FKED  [RESC1005X40X25ML05T05]  (value not drawn)
R57  CSR1206FK12L0  [FP-CSR1206-IPC_B]  (value not drawn)
R58  ERJ-6ENF1872V  [RESC2013X70X40LL20T20]  (value not drawn)
R59  RNCF0805BTE10K4  [RES_RNCF0805_STP]  (value not drawn)
R60  CRCW04021M00FKED  [FP-CRCW0402-e3-MFG]  (value not drawn)
RAS  CRCW1210100KFKEA  [FP-CRCW1210-e3-IPC_C]
RAS2  CRCW080510K0FKEAHP  [RESC2013X60X40NL15T20]  (value not drawn)
RAS3  CRCW1210100KFKEA  [FP-CRCW1210-e3-IPC_C]
RAS4  CRCW080510K0FKEAHP  [RESC2013X60X40NL15T20]
RF_LINK  B2B-PH-K-SLFSN  [CONN_B2B-PH-K-SLFSN_JST]
RJ6  CRCW08050000Z0EA  [RESC2013X50X30LL20T20]  (value not drawn)
RJ7  CRCW08050000Z0EA  [RESC2013X50X30LL20T20]  (value not drawn)
RL1  CRCW0805750RFKEA  [RESC2013X50X30NL20T20]  (value not drawn)
RL2  CRCW0805750RFKEA  [RESC2013X50X30NL20T20]  (value not drawn)
RL3  CRCW0805750RFKEA  [RESC2013X50X30NL20T20]  (value not drawn)
RL4  CRCW0805750RFKEA  [RESC2013X50X30NL20T20]  (value not drawn)
RL5  CRCW0805750RFKEA  [RESC2013X50X30NL20T20]  (value not drawn)
RL6  CRCW0805750RFKEA  [RESC2013X50X30NL20T20]  (value not drawn)
RL7  CRCW0805750RFKEA  [RESC2013X50X30NL20T20]  (value not drawn)
RL8  CRCW0805750RFKEA  [RESC2013X50X30NL20T20]  (value not drawn)
RL9  CRCW0805750RFKEA  [RESC2013X50X30NL20T20]  (value not drawn)
RM  CRCW1210100KFKEA  [FP-CRCW1210-e3-IPC_C]
RM2  CRCW080510K0FKEAHP  [RESC2013X60X40NL15T20]  (value not drawn)
RM3  CRCW1210100KFKEA  [FP-CRCW1210-e3-IPC_C]
RM4  CRCW080510K0FKEAHP  [RESC2013X60X40NL15T20]  (value not drawn)
servo  1720650202  [CONN_SD-768290002_02_MOL]
servo_F  3568  [FP-3568-MFG]
servo_L  LS L29K-H1J2-1-Z  [FP-LS_L29K-MFG]
U1  LM25116MHX/NOPB  [PWP0020A_N]
U2  LM25116MHX/NOPB  [PWP0020A_N]
U2_5.5  TLV271IDBVR  [DBV0005A_M]  (value not drawn)
U2_fans  TLV271IDBVR  [DBV0005A_M]  (value not drawn)
U2_mcm  TLV271IDBVR  [DBV0005A_M]  (value not drawn)
U2_MD  TLV271IDBVR  [DBV0005A_M]  (value not drawn)
U2_servo  TLV271IDBVR  [DBV0005A_M]  (value not drawn)
U2AS  TLV271IDBVR  [DBV0005A_M]  (value not drawn)
U3  LM25116MHX/NOPB  [PWP0020A_N]
U3.3  TLV271IDBVR  [DBV0005A_M]  (value not drawn)
U3.3_2  TLV271IDBVR  [DBV0005A_M]  (value not drawn)
U3_MD  TLV271IDBVR  [DBV0005A_M]  (value not drawn)
U3AS  TLV271IDBVR  [DBV0005A_M]  (value not drawn)
U4  LM25116MHX/NOPB  [PWP0020A_N]
U5  LM25116MHX/NOPB  [PWP0020A_N]
U5.5  TLV271IDBVR  [DBV0005A_M]  (value not drawn)
UA  SN74LVC1G08DBVRG4  [FP-DBV0005A-IPC_A]  (value not drawn)
UAS_1  TLV271IDBVR  [DBV0005A_M]  (value not drawn)
UAS_2  TLV271IDBVR  [DBV0005A_M]  (value not drawn)
Ufans  TLV271IDBVR  [DBV0005A_M]  (value not drawn)
Umcm  TLV271IDBVR  [DBV0005A_M]  (value not drawn)
UMD_1  TLV271IDBVR  [DBV0005A_M]  (value not drawn)
UMD_2  TLV271IDBVR  [DBV0005A_M]  (value not drawn)
Uservo  TLV271IDBVR  [DBV0005A_M]  (value not drawn)

### Nets
3.3+: Cb1.1 Cb2.1 Cb3.1 Cb4.1 Cb5.1 Cb6.1 Cb7.1 Cb8.1 Cb9.1 Cb11.1 Cb12.1 Cb13.1 Cb14.1 Cb15.1 Cb16.1 Cb17.1 Cb18.1 Cb19.1 U2_5.5.5(VDD) U2_fans.5(VDD) U2_mcm.5(VDD) U2_MD.5(VDD) U2_servo.5(VDD) U2AS.5(VDD) U3.3.5(VDD) U3.3_2.5(VDD) U3_MD.5(VDD) U3AS.5(VDD) U5.5.5(VDD) UA.5(VCC) UAS_1.5(VDD) UAS_2.5(VDD) Ufans.5(VDD) Umcm.5(VDD) UMD_1.5(VDD) UMD_2.5(VDD) Uservo.5(VDD)
+5: 5_E.1 5_ECB.1 5_LG.1 5V_F.2 R52.1
DGND: RF_LINK.2 UA.3(GND)
GND: 3.3_E.2 3.3_LG.2 3.3V_L.1(C) 5_E.2 5_ECB.2 5_LG.2 5V_L.1(C) 12_E.2 12_ECB.2 -.1 -.2 -.3 -.4 -.5 -.6 -.7 -.8 -.9 -.10 -.11 -.12 AS2_L.1(C) AS_1.2 AS_2.2 AS_L.1(C) C14.2 C15.2 C16.1 C17.2 C21.1 C22.2 C23.2 C24.2 C25.2 C26.1 C31.1 C40.2(A) C41.2(A) C42.2(A) C61.2 C62.2 C63.2 C64.1 C67.1 C69.2 C70.2 C71.1 C72.1 C75.1 C77.2 C78.2 C79.2 C80.2 C81.1 C84.1 C86.2 Cb1.2 Cb2.2 Cb3.2 Cb4.2 Cb5.2 Cb6.2 Cb7.2 Cb8.2 Cb9.2 Cb11.2 Cb12.2 Cb13.2 Cb14.2 Cb15.2 Cb16.2 Cb17.2 Cb18.2 Cb19.2 Cbp.2 Cbp2.2 Cin2.2 Cinx2.2 CR15.2 Fans.2 Fans_L.1(C) J2.2 K1.6 K2.6 MCM.2 MCM_L.1(C) MD_1.21 MD_1.22 MD_2.21 MD_2.22 MD_L.1(C) Motor.1(C) MP-.1 R3.1 R4.2 R6.1 R8.3 R11.2 R13.1 R14.2 R17.2 R19.1 R21.2 R23.1 R24.2 R27.2 R29.1 R41.2 R43.1 R44.2 R47.2 R49.1 R51.2 R54.1 R55.2 R57.2 R59.1 RAS2.1 RAS4.1 RM2.1 RM4.1 servo.2 servo_L.1(C) U1.6(AGND) U1.11(DEMB) U1.13(CSG) U1.14(PGND) U1.17(VCCX) U1.21(EP) U2.6(AGND) U2.11(DEMB) U2.13(CSG) U2.14(PGND) U2.17(VCCX) U2.21(EP) U2_5.5.2(GND) U2_fans.2(GND) U2_mcm.2(GND) U2_MD.2(GND) U2_servo.2(GND) U2AS.2(GND) U3.6(AGND) U3.11(DEMB) U3.13(CSG) U3.14(PGND) U3.17(VCCX) U3.21(EP) U3.3.2(GND) U3.3_2.2(GND) U3_MD.2(GND) U3AS.2(GND) U4.6(AGND) U4.11(DEMB) U4.13(CSG) U4.14(PGND) U4.17(VCCX) U4.21(EP) U5.6(AGND) U5.11(DEMB) U5.13(CSG) U5.14(PGND) U5.17(VCCX) U5.21(EP) U5.5.2(GND) UAS_1.2(GND) UAS_2.2(GND) Ufans.2(GND) Umcm.2(GND) UMD_1.2(GND) UMD_2.2(GND) Uservo.2(GND)
System+: CR15.1 K1.1 K2.1 MP+.1
3.3_Fuse: U3.3.1(OUT) U3.3.4(IN-) U3.3_2.3(IN+)
5.5_Fuse: U2_5.5.3(IN+) U5.5.1(OUT) U5.5.4(IN-)
AND_Output: UA.4(Y)
AS_Fuse1: U2AS.3(IN+) UAS_1.1(OUT) UAS_1.4(IN-)
AS_Fuse2: U3AS.3(IN+) UAS_2.1(OUT) UAS_2.4(IN-)
con1_voltage: JR.1 K1.5
con_voltage: K2.5
Fan_Fuse: U2_fans.3(IN+) Ufans.1(OUT) Ufans.4(IN-)
MCM_Fuse: U2_mcm.3(IN+) Umcm.1(OUT) Umcm.4(IN-)
MD_Fuse1: U2_MD.3(IN+) UMD_1.1(OUT) UMD_1.4(IN-)
MD_Fuse2: U3_MD.3(IN+) UMD_2.1(OUT) UMD_2.4(IN-)
micro_relay: UA.1(A)
Servo_Fuse: U2_servo.3(IN+) Uservo.1(OUT) Uservo.4(IN-)
Net3.3_E_1: 3.3_E.1 3.3_LG.1 3.3V_F.2 U3.3.3(IN+)
Net3.3V_F_1: 3.3V_F.1 C86.1 L1_5.2 R58.2 U5.10(VOUT)
Net3.3V_L_2: 3.3V_L.2(A) RL1.2
Net5V_F_1: 5V_F.1 C77.1 L1_4.1 R48.2 U4.10(VOUT)
Net5V_L_2: 5V_L.2(A) RL2.2
Net12_E_1: 12_E.1 12_ECB.1 Fans.1 Fans_F.2 P+fans.1 P+fans.2 P+fans.3 P+fans.4 P+fans.5 P+fans.6 P+fans.7 P+fans.8 P+fans.9 P+fans.10 P+fans.11 P+fans.12 R40.1
NetAS2_F_1: AS2_F.1 AS_F.1 K2.4 MD2_F.1 MD_F.1
NetAS2_F_2: AS2_F.2 AS_2.1 RAS3.1 RJ6.1
NetAS2_L_2: AS2_L.2(A) RL6.2
NetAS_1_1: AS_1.1 AS_F.2 RAS.1 RJ7.1
NetAS_L_2: AS_L.2(A) RL7.2
NetC14_1: C14.1 C15.1 C61.1 C62.1 C69.1 C70.1 C78.1 C79.1 Cin2.1 Cinx2.1 K1.4 M1.5-6-7-8(D) M1_2.5-6-7-8(D) M1_3.5-6-7-8(D) Q1.5-6-7-8(D) Q3.5-6-7-8(D) Q5.5-6-7-8(D) R1.1 R2.1 R12.1 R16.1 R22.1 R26.1 R42.1 R46.1 R53.1 R60.1 U1.1(VIN) U2.1(VIN) U3.1(VIN) U4.1(VIN) U5.1(VIN)
NetC16_2: C16.2 U1.5(RAMP)
NetC17_1: C17.1 U1.7(SS)
NetC18_1: C18.1 R5.2
NetC18_2: C18.2 C19.1 U1.9(COMP)
NetC19_2: C19.2 J2.1 R5.1 R7.2 R8.2 U1.8(FB)
NetC20_1: C20.1 L1.2 M1.1(S) M1.2(S) M1.3(S) M1_2.1(S) M1_2.2(S) M1_2.3(S) M2.5(Drain) M2.6(Drain) M2.7(Drain) M2.8(Drain) M2.9(Drain) U1.20(SW)
NetC20_2: C20.2 D1.1 U1.18(HB)
NetC21_2: C21.2 D1.2 U1.16(VCC)
NetC22_1: C22.1 C23.1 C24.1 L1.1 R7.1 servo_F.1 U1.10(VOUT)
NetC25_1: C25.1 U2.5(RAMP)
NetC26_2: C26.2 U2.7(SS)
NetC27_1: C27.1 C28.2 U2.9(COMP)
NetC27_2: C27.2 R15.1 R18.2 R19.2 U2.8(FB)
NetC28_1: C28.1 R15.2
NetC30_1: C30.1 L1_2.2 M1_3.1(S) M1_3.2(S) M1_3.3(S) M1_4.5-6-7-8(D) U2.20(SW)
NetC30_2: C30.2 D2.1 U2.18(HB)
NetC31_2: C31.2 D2.2 U2.16(VCC)
NetC40_1: C40.1(C) L1_2.1 MCM_F.1 R18.1 U2.10(VOUT)
NetC41_1: C41.1(C) C42.1(C) Fans_F.1 L1_3.1 R28.1 U3.10(VOUT)
NetC63_1: C63.1 U3.5(RAMP)
NetC64_2: C64.2 U3.7(SS)
NetC65_1: C65.1 R25.2
NetC65_2: C65.2 C66.1 U3.9(COMP)
NetC66_2: C66.2 R25.1 R28.2 R29.2 U3.8(FB)
NetC67_2: C67.2 D3.2 U3.16(VCC)
NetC68_1: C68.1 L1_3.2 Q1.1(S) Q1.2(S) Q1.3(S) Q2.5-6-7-8(D) U3.20(SW)
NetC68_2: C68.2 D3.1 U3.18(HB)
NetC71_2: C71.2 U4.5(RAMP)
NetC72_2: C72.2 U4.7(SS)
NetC73_1: C73.1 R45.1 R48.1 R49.2 U4.8(FB)
NetC73_2: C73.2 C74.2 U4.9(COMP)
NetC74_1: C74.1 R45.2
NetC75_2: C75.2 D4.2 U4.16(VCC)
NetC76_1: C76.1 L1_4.2 Q3.1(S) Q3.2(S) Q3.3(S) Q4.5-6-7-8(D) U4.20(SW)
NetC76_2: C76.2 D4.1 U4.18(HB)
NetC80_1: C80.1 U5.5(RAMP)
NetC81_2: C81.2 U5.7(SS)
NetC82_1: C82.1 R56.2
NetC82_2: C82.2 C83.2 U5.9(COMP)
NetC83_1: C83.1 R56.1 R58.1 R59.2 U5.8(FB)
NetC84_2: C84.2 D5.2 U5.16(VCC)
NetC85_1: C85.1 L1_5.1 Q5.1(S) Q5.2(S) Q5.3(S) Q6.5-6-7-8(D) U5.20(SW)
NetC85_2: C85.2 D5.1 U5.18(HB)
NetCbp2_1: Cbp2.1 RJ7.2
NetCbp_1: Cbp.1 RJ6.2
NetFans_L_2: Fans_L.2(A) RL3.2
NetM1_3_4: M1_3.4(G) U2.19(HO)
NetM1_4: M1.4(G) M1_2.4(G) U1.19(HO)
NetM1_4_1: M1_4.1(S) M1_4.2(S) M1_4.3(S) R17.1 U2.12(CS)
NetM1_4_4: M1_4.4(G) U2.15(LO)
NetM2_1: M2.1(Source) M2.2(Source) M2.3(Source) R6.2 U1.12(CS)
NetM2_4: M2.4(Gate) U1.15(LO)
NetMCM_1: MCM.1 MCM_F.2 R20.1
NetMCM_L_2: MCM_L.2(A) RL4.2
NetMD2_F_2: MD2_F.2 MD_2.11 MD_2.12 RM3.1
NetMD_1_11: MD_1.11 MD_1.12 MD_F.2 RM.1
NetMD_L_2: MD_L.2(A) RL9.2
NetMotor_2: Motor.2(A) RL8.2
NetQ1_4: Q1.4(G) U3.19(HO)
NetQ2_1: Q2.1(S) Q2.2(S) Q2.3(S) R27.1 U3.12(CS)
NetQ2_4: Q2.4(G) U3.15(LO)
NetQ3_4: Q3.4(G) U4.19(HO)
NetQ4_1: Q4.1(S) Q4.2(S) Q4.3(S) R47.1 U4.12(CS)
NetQ4_4: Q4.4(G) U4.15(LO)
NetQ5_4: Q5.4(G) U5.19(HO)
NetQ6_1: Q6.1(S) Q6.2(S) Q6.3(S) R57.1 U5.12(CS)
NetQ6_4: Q6.4(G) U5.15(LO)
NetR1_2: R1.2 U1.4(EN)
NetR2_2: R2.2 R3.2 U1.2(ULVO)
NetR4_1: R4.1 U1.3(RT/SYNC)
NetR9_1: R9.1 servo.1 servo_F.2
NetR9_2: R9.2 R11.1 Uservo.3(IN+)
NetR12_2: R12.2 R13.2 U2.2(ULVO)
NetR14_1: R14.1 U2.3(RT/SYNC)
NetR16_2: R16.2 U2.4(EN)
NetR20_2: R20.2 R21.1 Umcm.3(IN+)
NetR22_2: R22.2 R23.2 U3.2(ULVO)
NetR24_1: R24.1 U3.3(RT/SYNC)
NetR26_2: R26.2 U3.4(EN)
NetR40_2: R40.2 R41.1 Ufans.3(IN+)
NetR42_2: R42.2 R43.2 U4.2(ULVO)
NetR44_1: R44.1 U4.3(RT/SYNC)
NetR46_2: R46.2 U4.4(EN)
NetR51_1: R51.1 R52.2 U5.5.3(IN+)
NetR53_2: R53.2 R54.2 U5.2(ULVO)
NetR55_1: R55.1 U5.3(RT/SYNC)
NetR60_2: R60.2 U5.4(EN)
NetRAS3_2: RAS3.2 RAS4.2 UAS_2.3(IN+)
NetRAS_2: RAS.2 RAS2.2 UAS_1.3(IN+)
NetRF_LINK_1: RF_LINK.1 UA.2(B)
NetRL1_1: RL1.1 U3.3_2.1(OUT) U3.3_2.4(IN-)
NetRL2_1: RL2.1 U2_5.5.1(OUT) U2_5.5.4(IN-)
NetRL3_1: RL3.1 U2_fans.1(OUT) U2_fans.4(IN-)
NetRL4_1: RL4.1 U2_mcm.1(OUT) U2_mcm.4(IN-)
NetRL5_1: RL5.1 U2_servo.1(OUT) U2_servo.4(IN-)
NetRL5_2: RL5.2 servo_L.2(A)
NetRL6_1: RL6.1 U3AS.1(OUT) U3AS.4(IN-)
NetRL7_1: RL7.1 U2AS.1(OUT) U2AS.4(IN-)
NetRL8_1: RL8.1 U3_MD.1(OUT) U3_MD.4(IN-)
NetRL9_1: RL9.1 U2_MD.1(OUT) U2_MD.4(IN-)
NetRM3_2: RM3.2 RM4.2 UMD_2.3(IN+)
NetRM_2: RM.2 RM2.2 UMD_1.3(IN+)

Not connected (* = marked no-connect by the designer): MP1 1; MP2 1; MP3 1; MP4 1; R8 1

### Notes on the sheet
- Fuse Detection - Microcontroller
- (near UA) AND GATE/Switching Circuit
- replace
- eSTOP HEADER
- bypass caps on active suspension
- Changes to 8.4 volts
- Led holders
- Servos
- debug potentiometer
- MCM
- Cooling Fans
- 5V Logic
- Estop Power
- 3.3V Logic
- RT0805BRD0710K9L
- (in symbol CMP-05428-000019-2) +
- (in symbol CMP-05428-001123-1) +